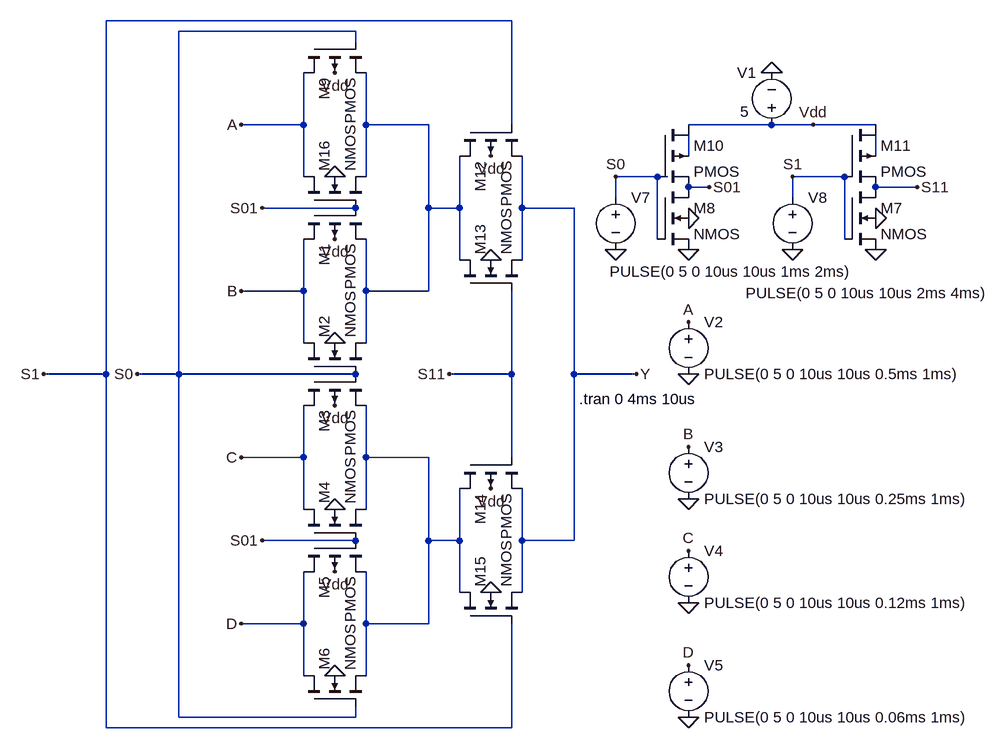
[diagram p0: schematic mux421TG.asc]
mux421TG.asc, the LTspice schematic file:
Version 4
SHEET 1 1552 680
WIRE 448 -1440 -176 -1440
WIRE 208 -1424 -64 -1424
WIRE 208 -1408 208 -1424
WIRE 128 -1280 128 -1360
WIRE 128 -1280 32 -1280
WIRE 224 -1280 224 -1360
WIRE 320 -1280 224 -1280
WIRE 448 -1280 448 -1440
WIRE 848 -1280 720 -1280
WIRE 912 -1280 848 -1280
WIRE 1008 -1280 912 -1280
WIRE 720 -1232 720 -1264
WIRE 1008 -1232 1008 -1264
WIRE 128 -1200 128 -1280
WIRE 224 -1200 224 -1280
WIRE 672 -1200 608 -1200
WIRE 688 -1200 672 -1200
WIRE 960 -1200 880 -1200
WIRE 752 -1184 720 -1184
WIRE 1072 -1184 1008 -1184
WIRE 608 -1168 608 -1200
WIRE 880 -1168 880 -1200
WIRE 208 -1152 64 -1152
WIRE 320 -1152 320 -1280
WIRE 368 -1152 368 -1232
WIRE 368 -1152 320 -1152
WIRE 464 -1152 464 -1232
WIRE 544 -1152 464 -1152
WIRE 672 -1104 672 -1200
WIRE 960 -1104 960 -1200
WIRE 368 -1072 368 -1152
WIRE 464 -1072 464 -1152
WIRE 128 -1024 128 -1104
WIRE 128 -1024 32 -1024
WIRE 224 -1024 224 -1104
WIRE 320 -1024 320 -1152
WIRE 320 -1024 224 -1024
WIRE 128 -944 128 -1024
WIRE 224 -944 224 -1024
WIRE -176 -896 -176 -1440
WIRE -176 -896 -272 -896
WIRE -64 -896 -64 -1424
WIRE -64 -896 -128 -896
WIRE 208 -896 -64 -896
WIRE 448 -896 448 -1024
WIRE 448 -896 352 -896
WIRE 544 -896 544 -1152
WIRE 640 -896 544 -896
WIRE 128 -768 128 -848
WIRE 128 -768 32 -768
WIRE 224 -768 224 -848
WIRE 320 -768 224 -768
WIRE 448 -768 448 -896
WIRE 128 -688 128 -768
WIRE 224 -688 224 -768
WIRE 208 -640 64 -640
WIRE 320 -640 320 -768
WIRE 368 -640 368 -720
WIRE 368 -640 320 -640
WIRE 464 -640 464 -720
WIRE 544 -640 544 -896
WIRE 544 -640 464 -640
WIRE 368 -560 368 -640
WIRE 464 -560 464 -640
WIRE 128 -512 128 -592
WIRE 128 -512 32 -512
WIRE 224 -512 224 -592
WIRE 320 -512 320 -640
WIRE 320 -512 224 -512
WIRE 128 -432 128 -512
WIRE 224 -432 224 -512
WIRE -64 -368 -64 -896
WIRE 208 -368 208 -384
WIRE 208 -368 -64 -368
WIRE -176 -352 -176 -896
WIRE 448 -352 448 -512
WIRE 448 -352 -176 -352
FLAG 32 -1280 A
FLAG 32 -1024 B
FLAG 32 -768 C
FLAG 32 -512 D
FLAG 1008 -1088 0
FLAG 720 -1088 0
FLAG 720 -1136 0
FLAG 1008 -1136 0
FLAG 752 -1184 S01
FLAG 1072 -1184 S11
FLAG 848 -1360 0
FLAG -128 -896 S0
FLAG 640 -896 Y
FLAG 64 -1152 S01
FLAG 64 -640 S01
FLAG 352 -896 S11
FLAG 176 -1360 Vdd
FLAG 176 -1104 Vdd
FLAG 176 -848 Vdd
FLAG 176 -592 Vdd
FLAG 416 -720 Vdd
FLAG 416 -1232 Vdd
FLAG 912 -1280 Vdd
FLAG -272 -896 S1
FLAG 720 -896 0
FLAG 720 -704 0
FLAG 720 -544 0
FLAG 720 -368 0
FLAG 176 -432 0
FLAG 176 -688 0
FLAG 176 -944 0
FLAG 176 -1200 0
FLAG 416 -560 0
FLAG 416 -1072 0
FLAG 608 -1088 0
FLAG 880 -1088 0
FLAG 608 -1200 S0
FLAG 880 -1200 S1
FLAG 720 -976 A
FLAG 720 -784 B
FLAG 720 -624 C
FLAG 720 -448 D
SYMBOL pmos4 128 -1408 M90
SYMATTR InstName M9
SYMATTR Value2 l=2 w=10
SYMBOL nmos4 128 -1152 R270
SYMATTR InstName M16
SYMATTR Value2 l=2 w=10
SYMBOL pmos4 128 -1152 M90
SYMATTR InstName M1
SYMATTR Value2 l=2 w=10
SYMBOL nmos4 128 -896 R270
SYMATTR InstName M2
SYMATTR Value2 l=2 w=10
SYMBOL pmos4 128 -896 M90
SYMATTR InstName M3
SYMATTR Value2 l=2 w=10
SYMBOL nmos4 128 -640 R270
SYMATTR InstName M4
SYMATTR Value2 l=2 w=10
SYMBOL pmos4 128 -640 M90
SYMATTR InstName M5
SYMATTR Value2 l=2 w=10
SYMBOL nmos4 128 -384 R270
SYMATTR InstName M6
SYMATTR Value2 l=2 w=10
SYMBOL nmos4 960 -1184 R0
SYMATTR InstName M7
SYMATTR Value2 l=2 w=10
SYMBOL nmos4 672 -1184 R0
SYMATTR InstName M8
SYMATTR Value2 l=2 w=10
SYMBOL pmos4 672 -1280 R0
SYMATTR InstName M10
SYMATTR Value2 l=2 w=10
SYMBOL pmos4 960 -1280 R0
SYMATTR InstName M11
SYMATTR Value2 l=2 w=10
SYMBOL pmos4 368 -1280 M90
SYMATTR InstName M12
SYMATTR Value2 l=2 w=10
SYMBOL nmos4 368 -1024 R270
SYMATTR InstName M13
SYMATTR Value2 l=2 w=10
SYMBOL pmos4 368 -768 M90
SYMATTR InstName M14
SYMATTR Value2 l=2 w=10
SYMBOL nmos4 368 -512 R270
SYMATTR InstName M15
SYMATTR Value2 l=2 w=10
SYMBOL voltage 848 -1264 R180
WINDOW 0 24 96 Left 2
WINDOW 3 35 36 Left 2
WINDOW 123 0 0 Left 2
WINDOW 39 0 0 Left 2
SYMATTR InstName V1
SYMATTR Value 5
SYMBOL voltage 720 -992 R0
WINDOW 123 0 0 Left 2
WINDOW 39 0 0 Left 2
SYMATTR InstName V2
SYMATTR Value PULSE(0 5 0 10us 10us 0.5ms 1ms)
SYMBOL voltage 720 -800 R0
WINDOW 123 0 0 Left 2
WINDOW 39 0 0 Left 2
SYMATTR InstName V3
SYMATTR Value PULSE(0 5 0 10us 10us 0.25ms 1ms)
SYMBOL voltage 720 -640 R0
WINDOW 123 0 0 Left 2
WINDOW 39 0 0 Left 2
SYMATTR InstName V4
SYMATTR Value PULSE(0 5 0 10us 10us 0.12ms 1ms)
SYMBOL voltage 720 -464 R0
WINDOW 123 0 0 Left 2
WINDOW 39 0 0 Left 2
SYMATTR InstName V5
SYMATTR Value PULSE(0 5 0 10us 10us 0.06ms 1ms)
SYMBOL voltage 608 -1184 R0
WINDOW 3 -9 130 Left 2
WINDOW 123 0 0 Left 2
WINDOW 39 0 0 Left 2
SYMATTR InstName V7
SYMATTR Value PULSE(0 5 0 10us 10us 1ms 2ms)
SYMBOL voltage 880 -1184 R0
WINDOW 3 -72 163 Left 2
WINDOW 123 0 0 Left 2
WINDOW 39 0 0 Left 2
SYMATTR InstName V8
SYMATTR Value PULSE(0 5 0 10us 10us 2ms 4ms)
TEXT 552 -858 Left 2 !.tran 0 4ms 10us

The netlist it stands for:
* mux421TG.asc
M9 A S0 N001 Vdd PMOS l=2 w=10
M16 A S01 N001 0 NMOS l=2 w=10
M1 B S01 N001 Vdd PMOS l=2 w=10
M2 B S0 N001 0 NMOS l=2 w=10
M3 C S0 N004 Vdd PMOS l=2 w=10
M4 C S01 N004 0 NMOS l=2 w=10
M5 D S01 N004 Vdd PMOS l=2 w=10
M6 D S0 N004 0 NMOS l=2 w=10
M7 S11 S1 0 0 NMOS l=2 w=10
M8 S01 S0 0 0 NMOS l=2 w=10
M10 Vdd S0 S01 N002 PMOS l=2 w=10
M11 Vdd S1 S11 N003 PMOS l=2 w=10
M12 N001 S1 Y Vdd PMOS l=2 w=10
M13 N001 S11 Y 0 NMOS l=2 w=10
M14 N004 S11 Y Vdd PMOS l=2 w=10
M15 N004 S1 Y 0 NMOS l=2 w=10
V1 Vdd 0 5
V2 A 0 PULSE(0 5 0 10us 10us 0.5ms 1ms)
V3 B 0 PULSE(0 5 0 10us 10us 0.25ms 1ms)
V4 C 0 PULSE(0 5 0 10us 10us 0.12ms 1ms)
V5 D 0 PULSE(0 5 0 10us 10us 0.06ms 1ms)
V7 S0 0 PULSE(0 5 0 10us 10us 1ms 2ms)
V8 S1 0 PULSE(0 5 0 10us 10us 2ms 4ms)
.model NMOS NMOS
.model PMOS PMOS
.lib standard.mos
.tran 0 4ms 10us
.backanno
.end